# EAGLE schematic led_table_final (EAGLE 7.6.0)
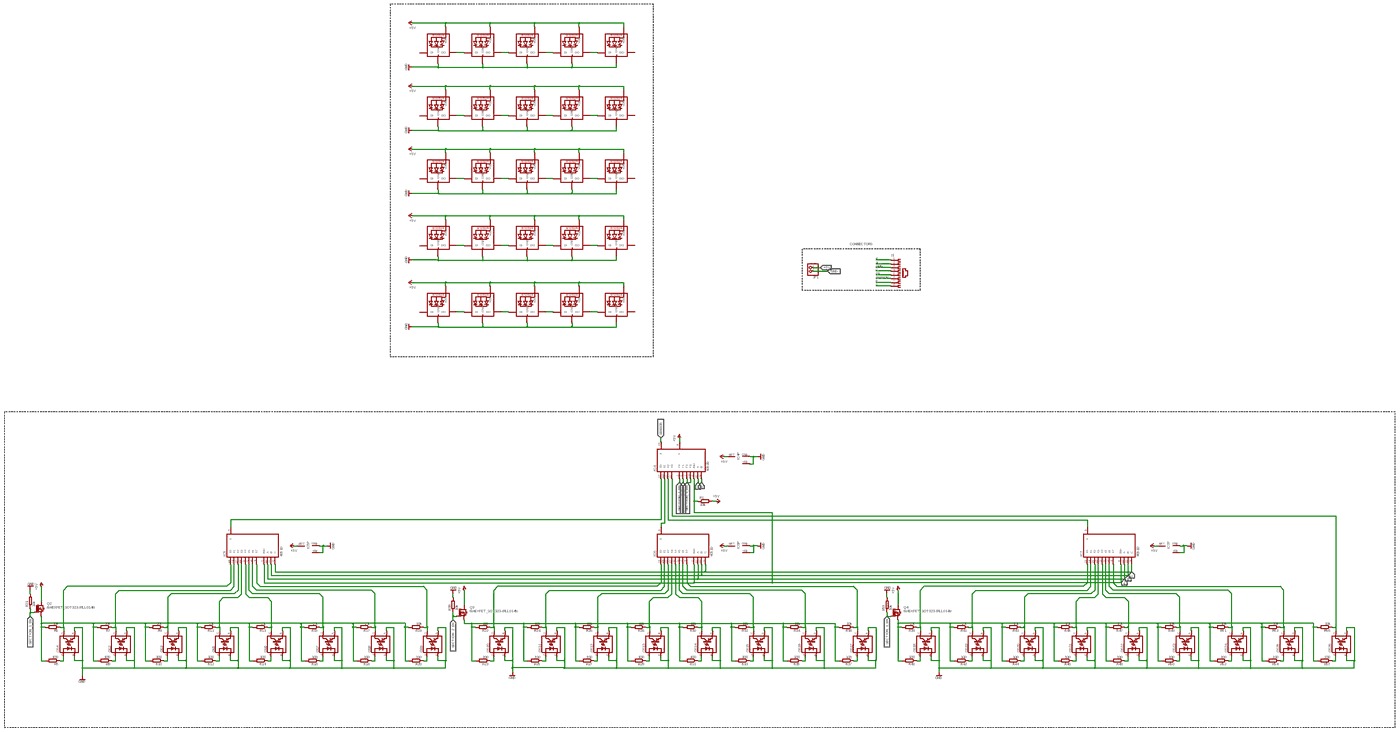
[diagram p0: schematic, sheet 1, overview]
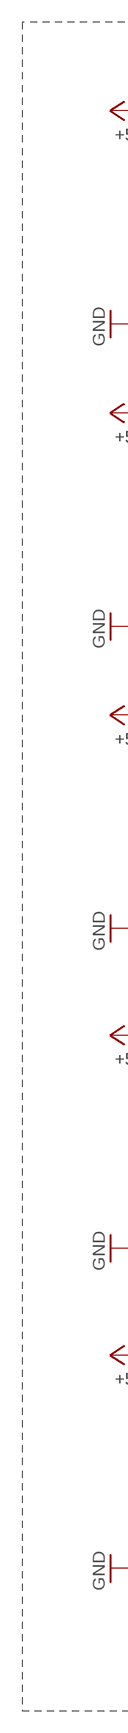
[diagram p1: schematic, sheet 1, part 1 of 5]
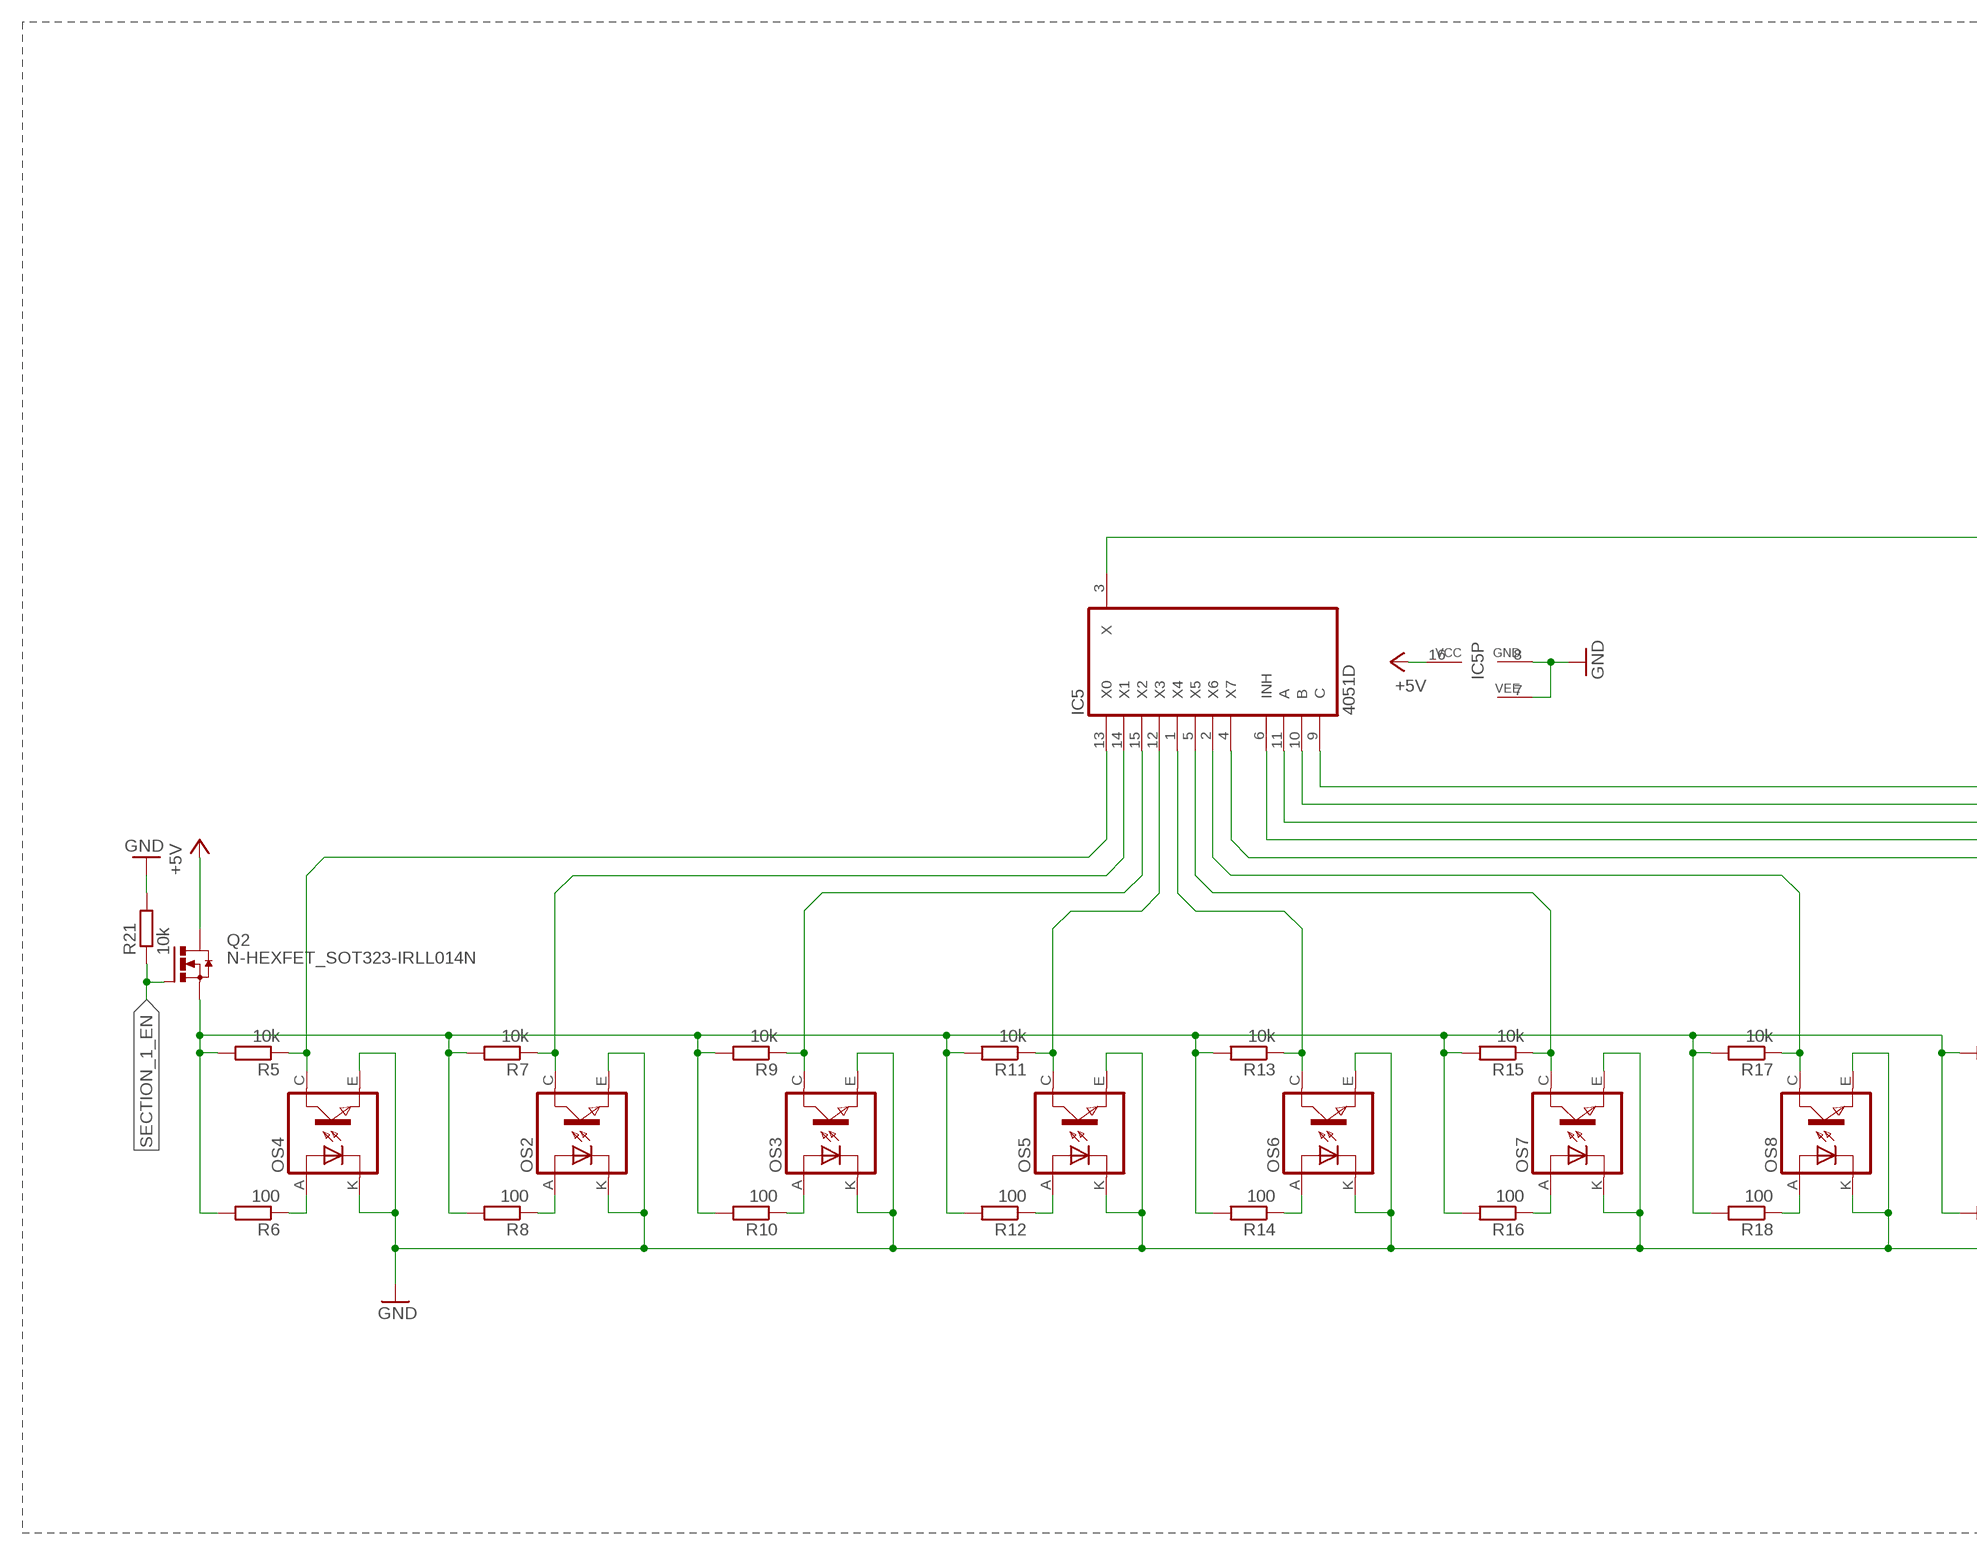
[diagram p2: schematic, sheet 1, part 2 of 5]
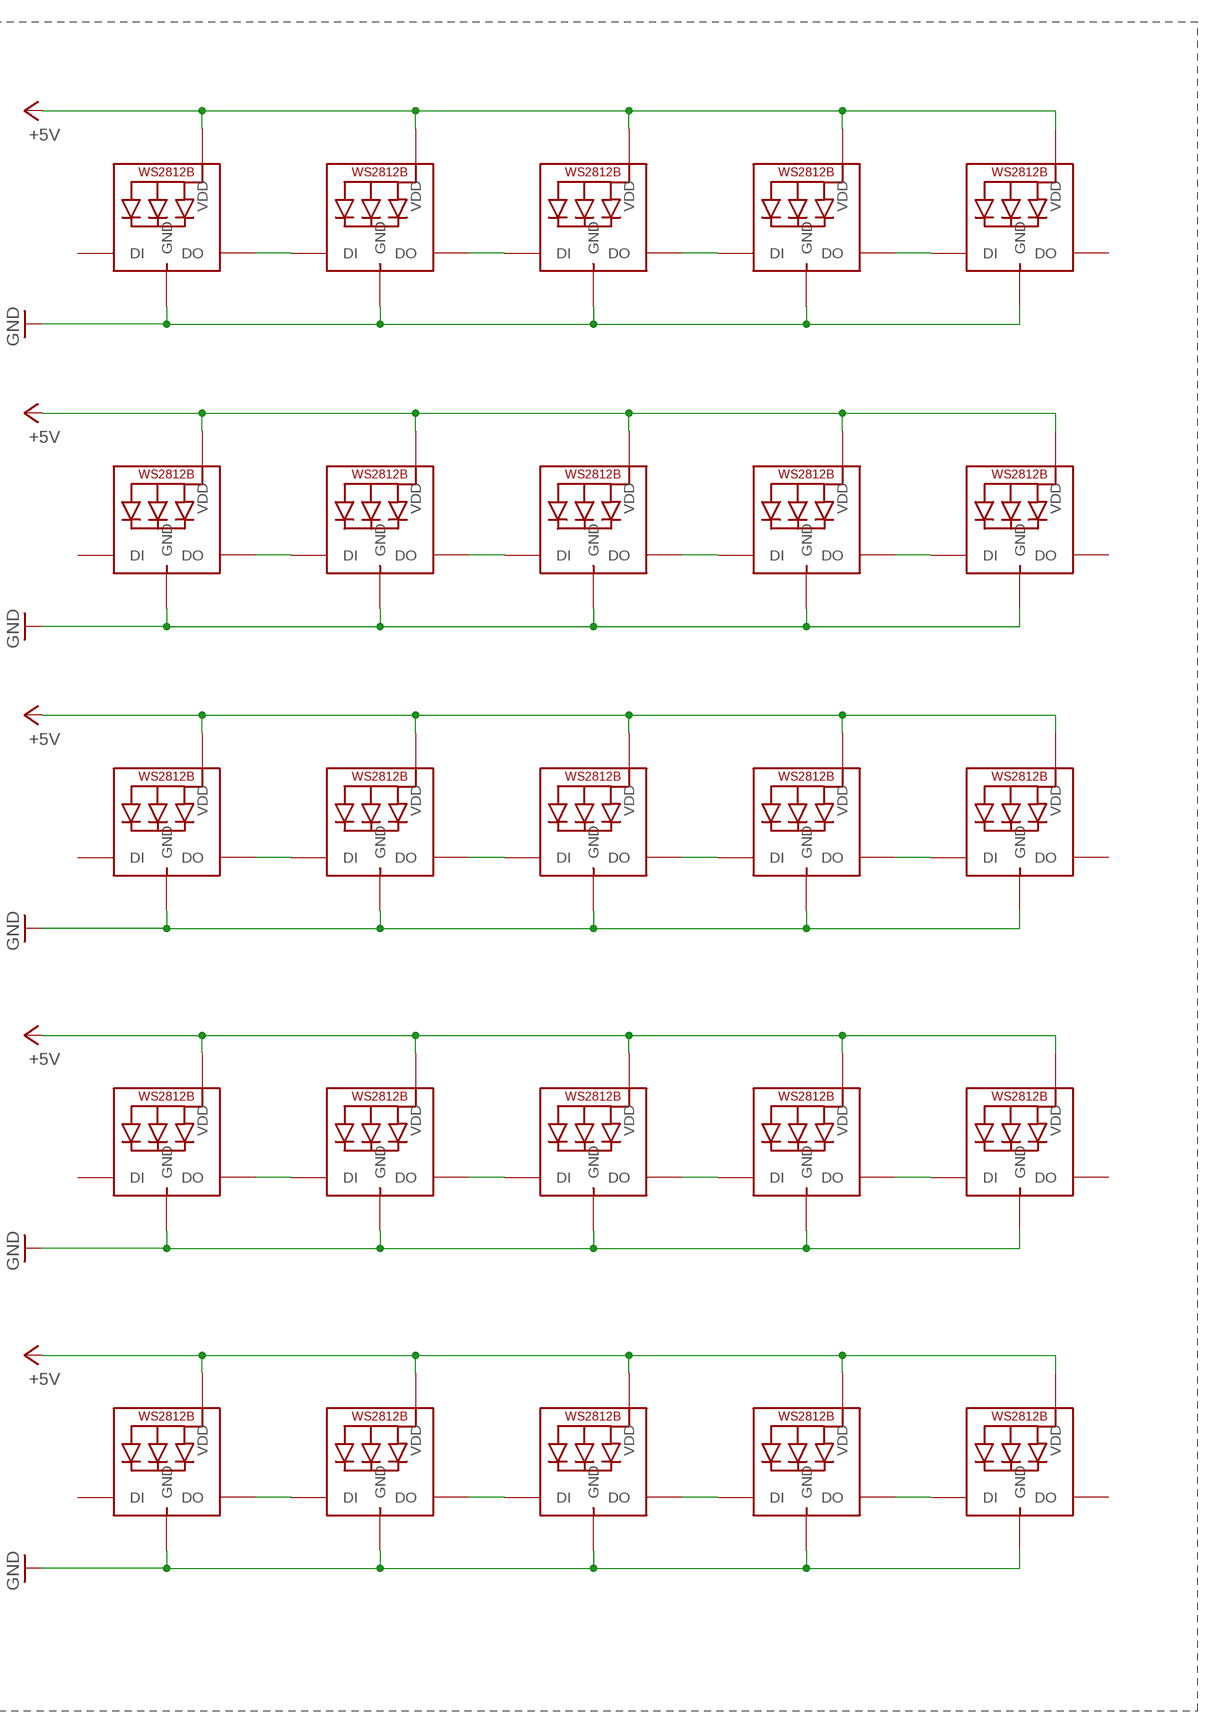
[diagram p3: schematic, sheet 1, part 3 of 5]
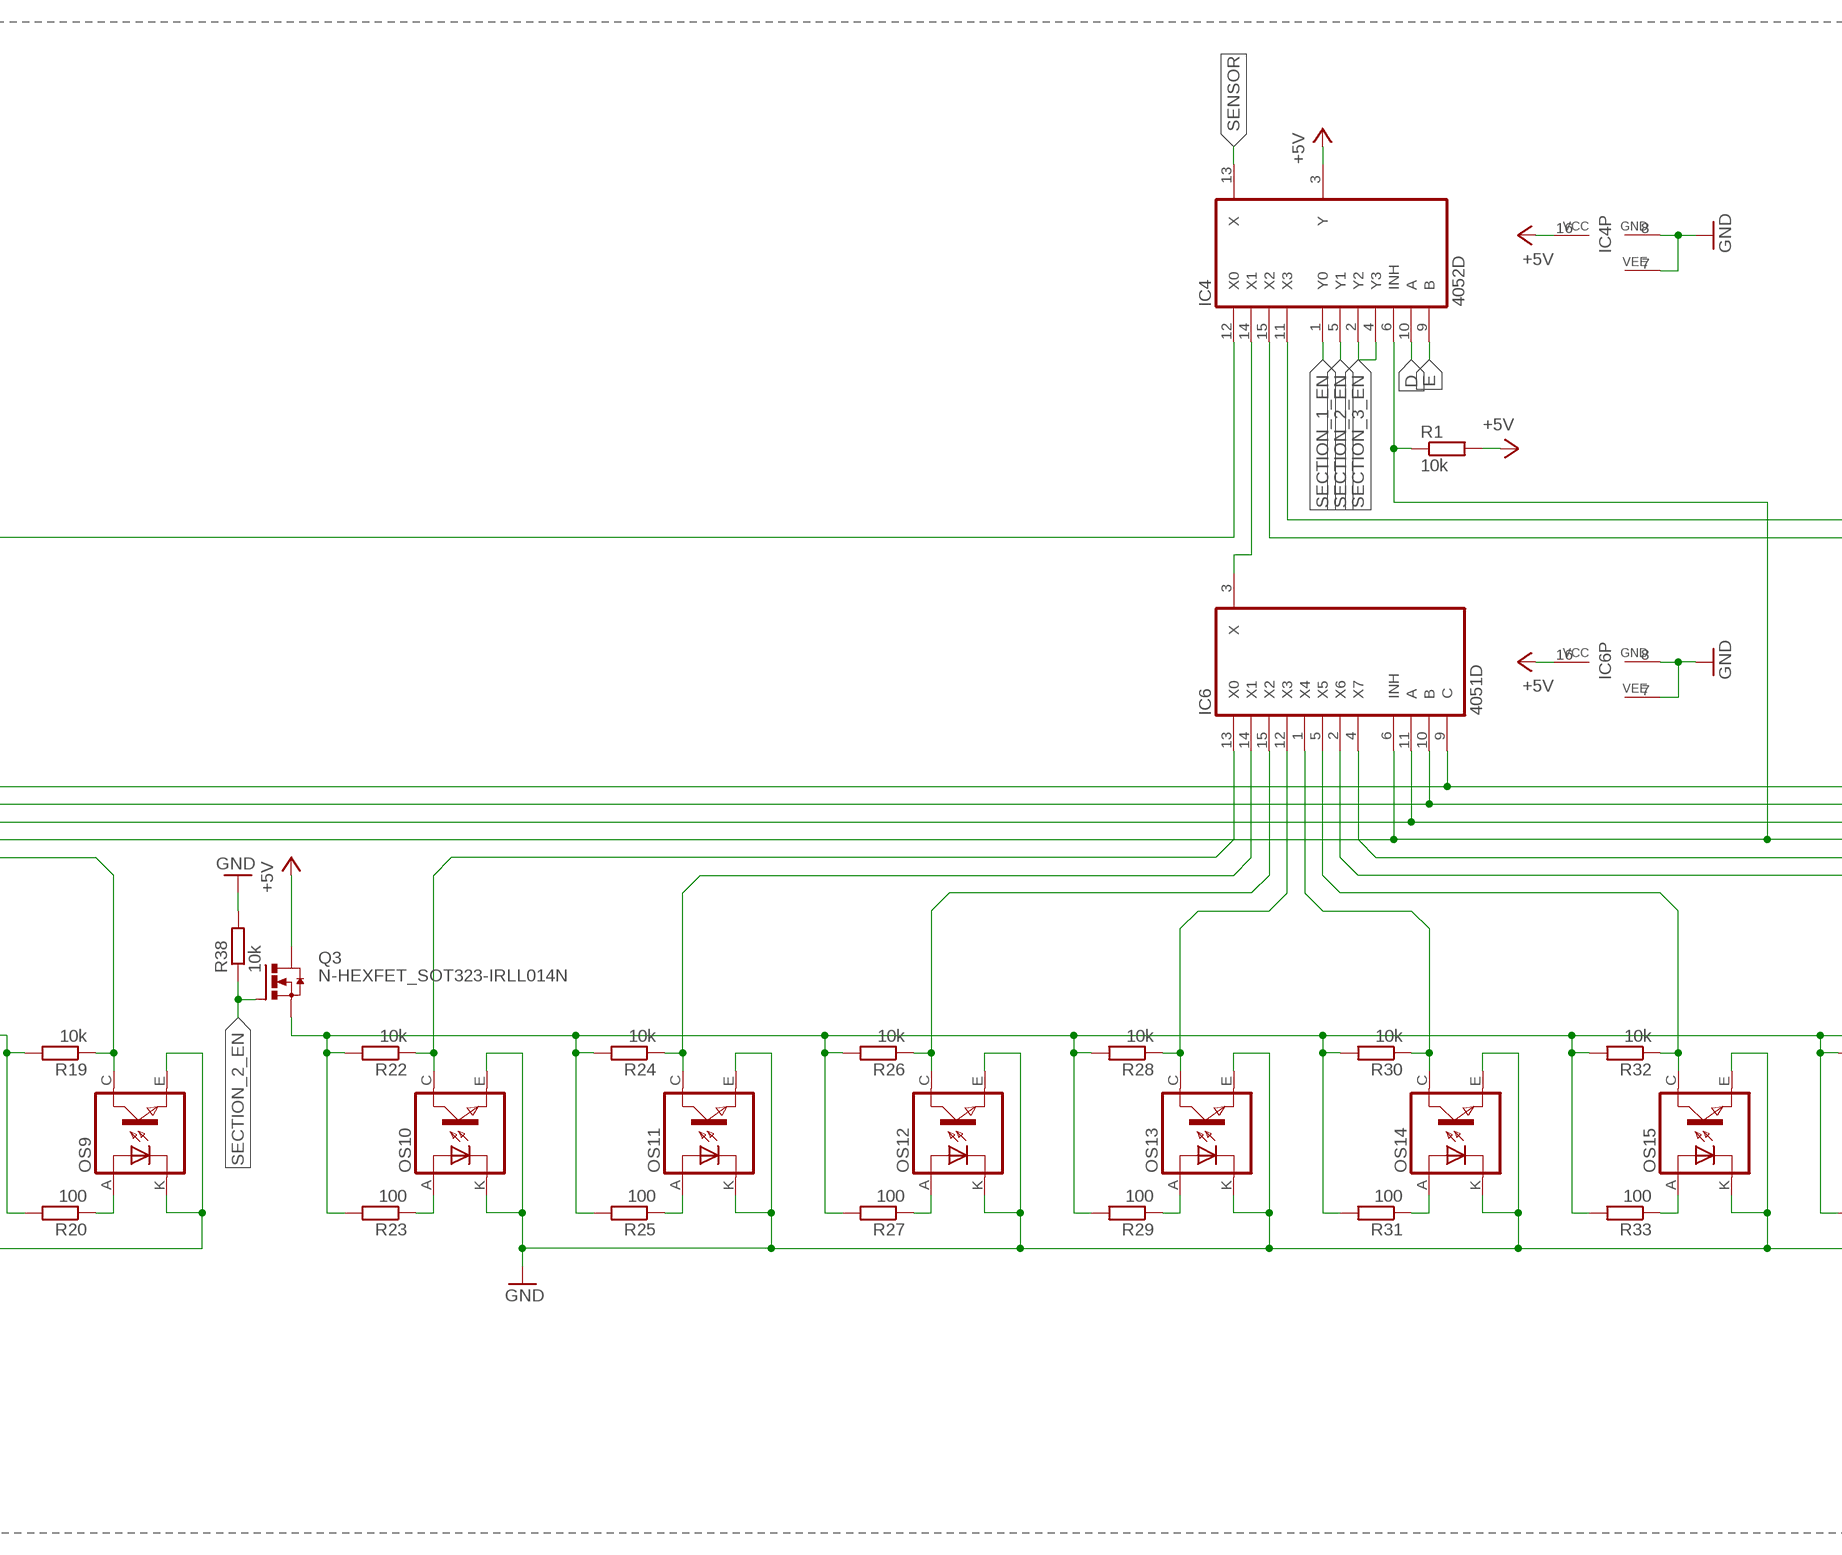
[diagram p4: schematic, sheet 1, part 4 of 5]
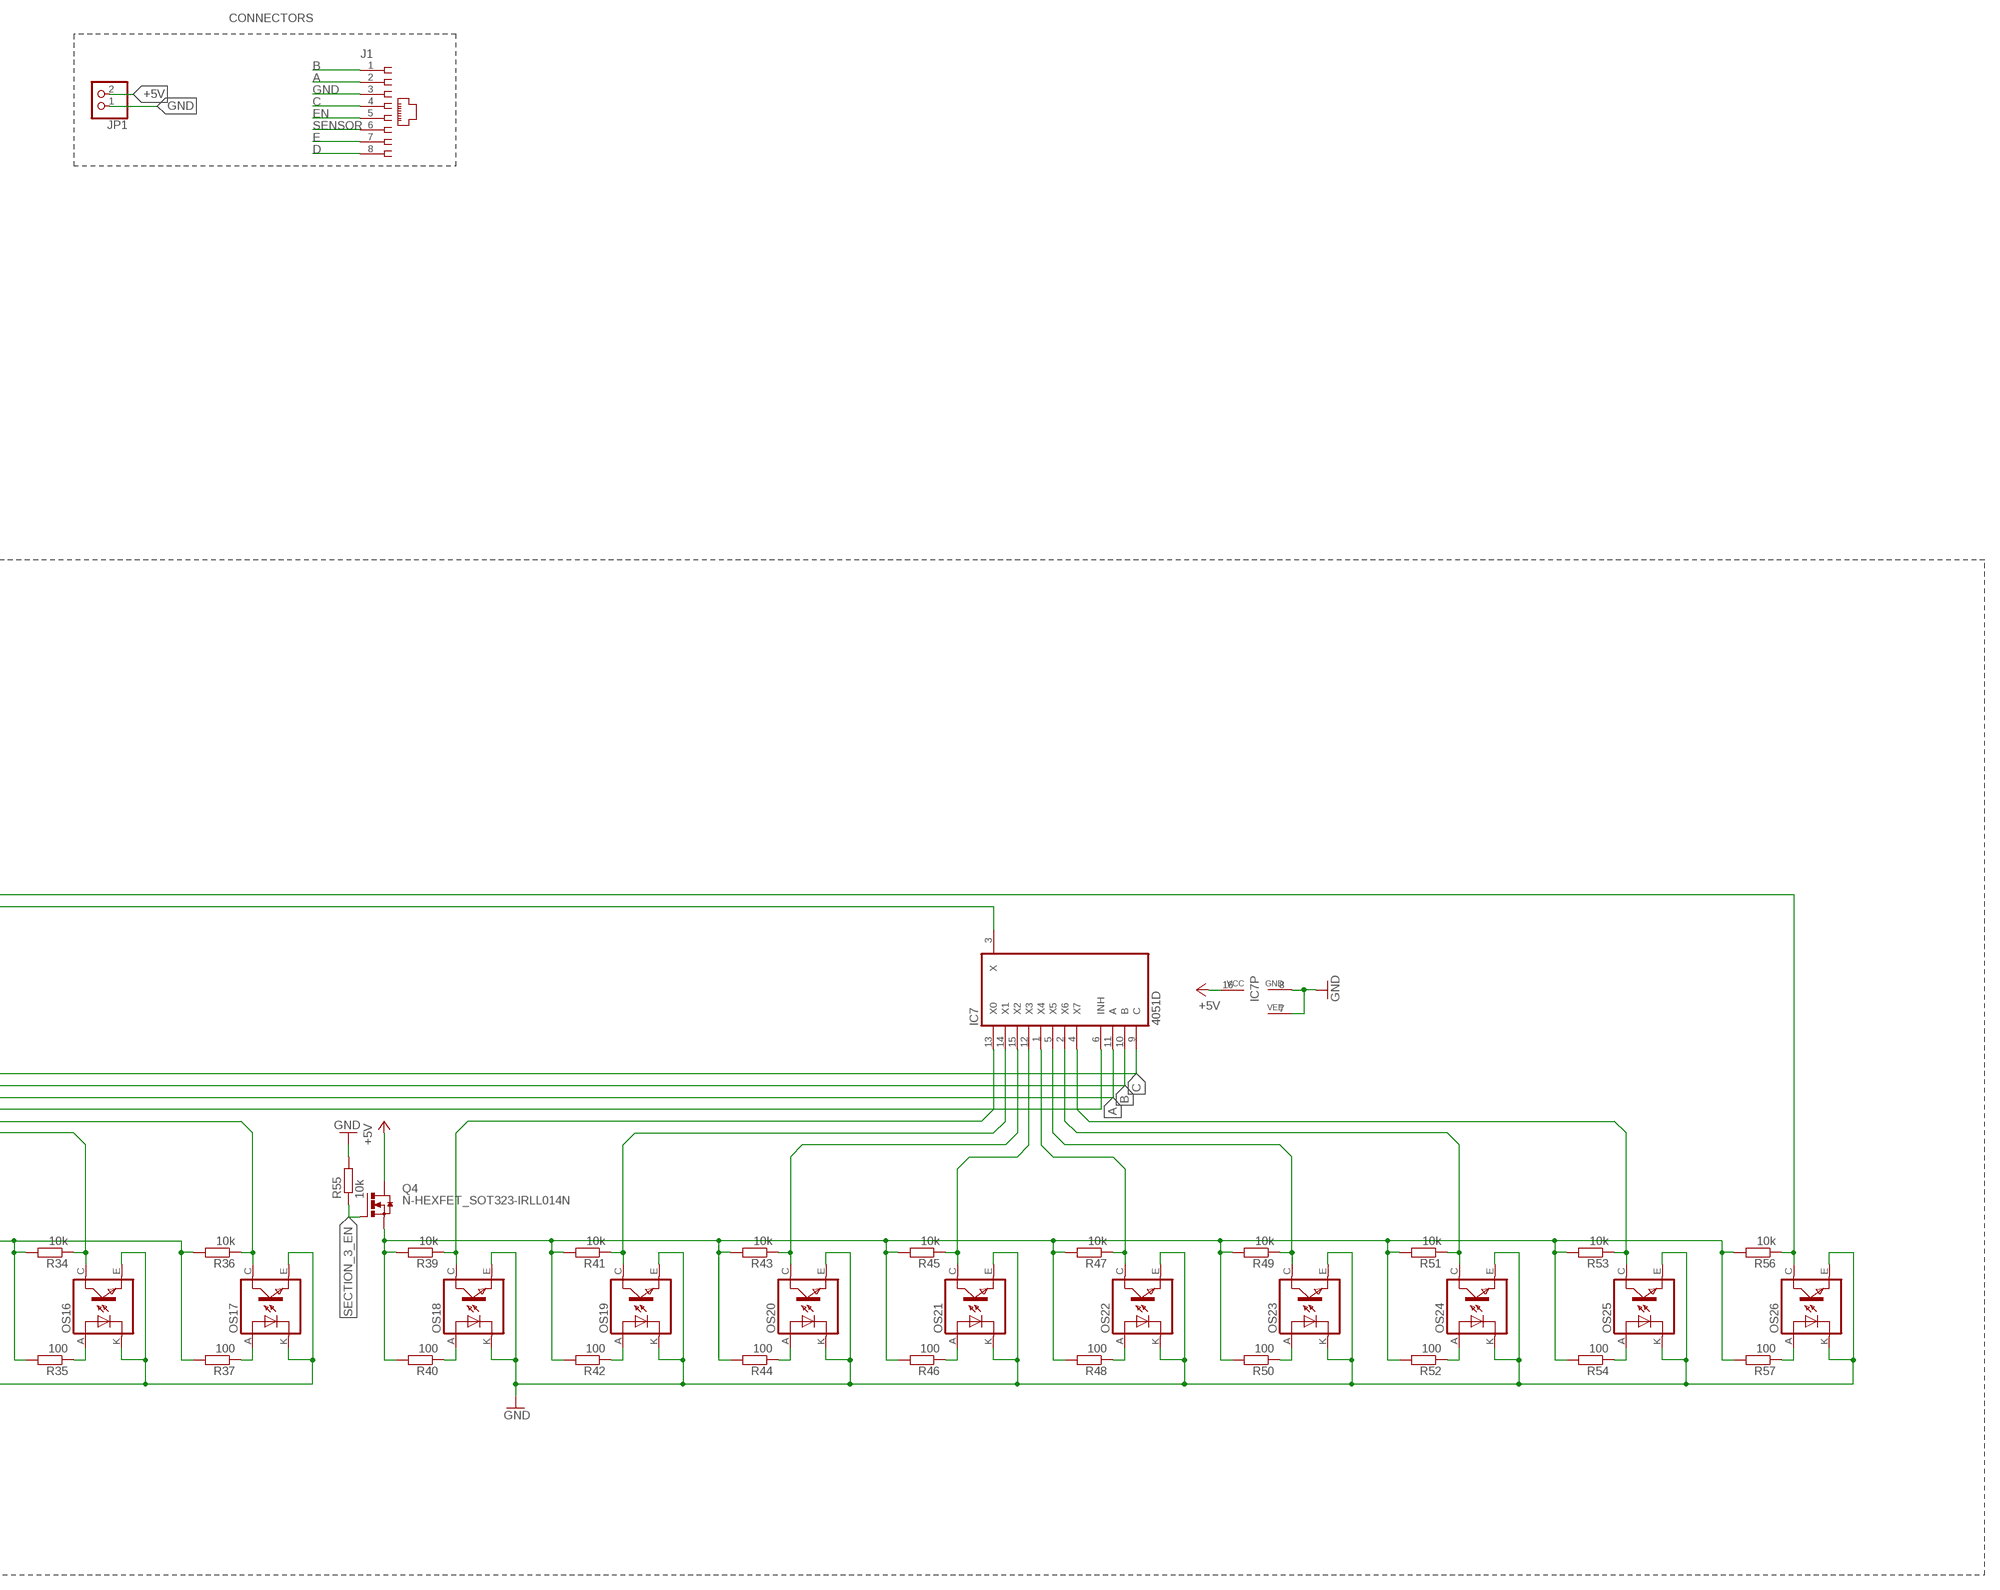
[diagram p5: schematic, sheet 1, part 5 of 5]

## Parts
IC4  4052D  [SO16]
IC5  4051D  [SO16]
IC6  4051D  [SO16]
IC7  4051D  [SO16]
J1  556416-1  [556416-1]
JP1  PINHD-1X2  [1X02]
LED1  WS2812B  [WS2812B_ON_STRIP]
LED2  WS2812B  [WS2812B_ON_STRIP]
LED3  WS2812B  [WS2812B_ON_STRIP]
LED4  WS2812B  [WS2812B_ON_STRIP]
LED5  WS2812B  [WS2812B_ON_STRIP]
LED6  WS2812B  [WS2812B_ON_STRIP]
LED7  WS2812B  [WS2812B_ON_STRIP]
LED8  WS2812B  [WS2812B_ON_STRIP]
LED9  WS2812B  [WS2812B_ON_STRIP]
LED10  WS2812B  [WS2812B_ON_STRIP]
LED11  WS2812B  [WS2812B_ON_STRIP]
LED12  WS2812B  [WS2812B_ON_STRIP]
LED13  WS2812B  [WS2812B_ON_STRIP]
LED14  WS2812B  [WS2812B_ON_STRIP]
LED15  WS2812B  [WS2812B_ON_STRIP]
LED16  WS2812B  [WS2812B_ON_STRIP]
LED17  WS2812B  [WS2812B_ON_STRIP]
LED18  WS2812B  [WS2812B_ON_STRIP]
LED19  WS2812B  [WS2812B_ON_STRIP]
LED20  WS2812B  [WS2812B_ON_STRIP]
LED21  WS2812B  [WS2812B_ON_STRIP]
LED22  WS2812B  [WS2812B_ON_STRIP]
LED23  WS2812B  [WS2812B_ON_STRIP]
LED24  WS2812B  [WS2812B_ON_STRIP]
LED25  WS2812B  [WS2812B_ON_STRIP]
OS2  TCRT5000  [TCRT5000]
OS3  TCRT5000  [TCRT5000]
OS4  TCRT5000  [TCRT5000]
OS5  TCRT5000  [TCRT5000]
OS6  TCRT5000  [TCRT5000]
OS7  TCRT5000  [TCRT5000]
OS8  TCRT5000  [TCRT5000]
OS9  TCRT5000  [TCRT5000]
OS10  TCRT5000  [TCRT5000]
OS11  TCRT5000  [TCRT5000]
OS12  TCRT5000  [TCRT5000]
OS13  TCRT5000  [TCRT5000]
OS14  TCRT5000  [TCRT5000]
OS15  TCRT5000  [TCRT5000]
OS16  TCRT5000  [TCRT5000]
OS17  TCRT5000  [TCRT5000]
OS18  TCRT5000  [TCRT5000]
OS19  TCRT5000  [TCRT5000]
OS20  TCRT5000  [TCRT5000]
OS21  TCRT5000  [TCRT5000]
OS22  TCRT5000  [TCRT5000]
OS23  TCRT5000  [TCRT5000]
OS24  TCRT5000  [TCRT5000]
OS25  TCRT5000  [TCRT5000]
OS26  TCRT5000  [TCRT5000]
Q2  N-HEXFET_SOT323-IRLL014N  [SOT223]
Q3  N-HEXFET_SOT323-IRLL014N  [SOT223]
Q4  N-HEXFET_SOT323-IRLL014N  [SOT223]
R1  10k  R-EU_R1206  [R1206]
R5  10k  R-EU_R1206  [R1206]
R6  100  R-EU_R1206  [R1206]
R7  10k  R-EU_R1206  [R1206]
R8  100  R-EU_R1206  [R1206]
R9  10k  R-EU_R1206  [R1206]
R10  100  R-EU_R1206  [R1206]
R11  10k  R-EU_R1206  [R1206]
R12  100  R-EU_R1206  [R1206]
R13  10k  R-EU_R1206  [R1206]
R14  100  R-EU_R1206  [R1206]
R15  10k  R-EU_R1206  [R1206]
R16  100  R-EU_R1206  [R1206]
R17  10k  R-EU_R1206  [R1206]
R18  100  R-EU_R1206  [R1206]
R19  10k  R-EU_R1206  [R1206]
R20  100  R-EU_R1206  [R1206]
R21  10k  R-EU_R1206  [R1206]
R22  10k  R-EU_R1206  [R1206]
R23  100  R-EU_R1206  [R1206]
R24  10k  R-EU_R1206  [R1206]
R25  100  R-EU_R1206  [R1206]
R26  10k  R-EU_R1206  [R1206]
R27  100  R-EU_R1206  [R1206]
R28  10k  R-EU_R1206  [R1206]
R29  100  R-EU_R1206  [R1206]
R30  10k  R-EU_R1206  [R1206]
R31  100  R-EU_R1206  [R1206]
R32  10k  R-EU_R1206  [R1206]
R33  100  R-EU_R1206  [R1206]
R34  10k  R-EU_R1206  [R1206]
R35  100  R-EU_R1206  [R1206]
R36  10k  R-EU_R1206  [R1206]
R37  100  R-EU_R1206  [R1206]
R38  10k  R-EU_R1206  [R1206]
R39  10k  R-EU_R1206  [R1206]
R40  100  R-EU_R1206  [R1206]
R41  10k  R-EU_R1206  [R1206]
R42  100  R-EU_R1206  [R1206]
R43  10k  R-EU_R1206  [R1206]
R44  100  R-EU_R1206  [R1206]
R45  10k  R-EU_R1206  [R1206]
R46  100  R-EU_R1206  [R1206]
R47  10k  R-EU_R1206  [R1206]
R48  100  R-EU_R1206  [R1206]
R49  10k  R-EU_R1206  [R1206]
R50  100  R-EU_R1206  [R1206]
R51  10k  R-EU_R1206  [R1206]
R52  100  R-EU_R1206  [R1206]
R53  10k  R-EU_R1206  [R1206]
R54  100  R-EU_R1206  [R1206]
R55  10k  R-EU_R1206  [R1206]
R56  10k  R-EU_R1206  [R1206]
R57  100  R-EU_R1206  [R1206]

## Nets
+5V: IC4.3(Y) IC4.16(VCC) IC5.16(VCC) IC6.16(VCC) IC7.16(VCC) JP1.2 LED1.VCC_IN(VDD) LED1.VCC_OUT(VDD) LED2.VCC_IN(VDD) LED2.VCC_OUT(VDD) LED3.VCC_IN(VDD) LED3.VCC_OUT(VDD) LED4.VCC_IN(VDD) LED4.VCC_OUT(VDD) LED5.VCC_IN(VDD) LED5.VCC_OUT(VDD) LED6.VCC_IN(VDD) LED6.VCC_OUT(VDD) LED7.VCC_IN(VDD) LED7.VCC_OUT(VDD) LED8.VCC_IN(VDD) LED8.VCC_OUT(VDD) LED9.VCC_IN(VDD) LED9.VCC_OUT(VDD) LED10.VCC_IN(VDD) LED10.VCC_OUT(VDD) LED11.VCC_IN(VDD) LED11.VCC_OUT(VDD) LED12.VCC_IN(VDD) LED12.VCC_OUT(VDD) LED13.VCC_IN(VDD) LED13.VCC_OUT(VDD) LED14.VCC_IN(VDD) LED14.VCC_OUT(VDD) LED15.VCC_IN(VDD) LED15.VCC_OUT(VDD) LED16.VCC_IN(VDD) LED16.VCC_OUT(VDD) LED17.VCC_IN(VDD) LED17.VCC_OUT(VDD) LED18.VCC_IN(VDD) LED18.VCC_OUT(VDD) LED19.VCC_IN(VDD) LED19.VCC_OUT(VDD) LED20.VCC_IN(VDD) LED20.VCC_OUT(VDD) LED21.VCC_IN(VDD) LED21.VCC_OUT(VDD) LED22.VCC_IN(VDD) LED22.VCC_OUT(VDD) LED23.VCC_IN(VDD) LED23.VCC_OUT(VDD) LED24.VCC_IN(VDD) LED24.VCC_OUT(VDD) LED25.VCC_IN(VDD) LED25.VCC_OUT(VDD) Q2.4(D) Q3.4(D) Q4.4(D) R1.2
A: IC5.11(A) IC6.11(A) IC7.11(A) J1.2
B: IC5.10(B) IC6.10(B) IC7.10(B) J1.1
C: IC5.9(C) IC6.9(C) IC7.9(C) J1.4
D: IC4.10(A) J1.8
E: IC4.9(B) J1.7
EN: IC4.6(INH) IC5.6(INH) IC6.6(INH) IC7.6(INH) J1.5 R1.1
GND: IC4.7(VEE) IC4.8(GND) IC5.7(VEE) IC5.8(GND) IC6.7(VEE) IC6.8(GND) IC7.7(VEE) IC7.8(GND) J1.3 JP1.1 LED1.GND_IN(GND) LED1.GND_OUT(GND) LED2.GND_IN(GND) LED2.GND_OUT(GND) LED3.GND_IN(GND) LED3.GND_OUT(GND) LED4.GND_IN(GND) LED4.GND_OUT(GND) LED5.GND_IN(GND) LED5.GND_OUT(GND) LED6.GND_IN(GND) LED6.GND_OUT(GND) LED7.GND_IN(GND) LED7.GND_OUT(GND) LED8.GND_IN(GND) LED8.GND_OUT(GND) LED9.GND_IN(GND) LED9.GND_OUT(GND) LED10.GND_IN(GND) LED10.GND_OUT(GND) LED11.GND_IN(GND) LED11.GND_OUT(GND) LED12.GND_IN(GND) LED12.GND_OUT(GND) LED13.GND_IN(GND) LED13.GND_OUT(GND) LED14.GND_IN(GND) LED14.GND_OUT(GND) LED15.GND_IN(GND) LED15.GND_OUT(GND) LED16.GND_IN(GND) LED16.GND_OUT(GND) LED17.GND_IN(GND) LED17.GND_OUT(GND) LED18.GND_IN(GND) LED18.GND_OUT(GND) LED19.GND_IN(GND) LED19.GND_OUT(GND) LED20.GND_IN(GND) LED20.GND_OUT(GND) LED21.GND_IN(GND) LED21.GND_OUT(GND) LED22.GND_IN(GND) LED22.GND_OUT(GND) LED23.GND_IN(GND) LED23.GND_OUT(GND) LED24.GND_IN(GND) LED24.GND_OUT(GND) LED25.GND_IN(GND) LED25.GND_OUT(GND) OS2.E(EMITTER) OS2.K(CATHODE) OS3.E(EMITTER) OS3.K(CATHODE) OS4.E(EMITTER) OS4.K(CATHODE) OS5.E(EMITTER) OS5.K(CATHODE) OS6.E(EMITTER) OS6.K(CATHODE) OS7.E(EMITTER) OS7.K(CATHODE) OS8.E(EMITTER) OS8.K(CATHODE) OS9.E(EMITTER) OS9.K(CATHODE) OS10.E(EMITTER) OS10.K(CATHODE) OS11.E(EMITTER) OS11.K(CATHODE) OS12.E(EMITTER) OS12.K(CATHODE) OS13.E(EMITTER) OS13.K(CATHODE) OS14.E(EMITTER) OS14.K(CATHODE) OS15.E(EMITTER) OS15.K(CATHODE) OS16.E(EMITTER) OS16.K(CATHODE) OS17.E(EMITTER) OS17.K(CATHODE) OS18.E(EMITTER) OS18.K(CATHODE) OS19.E(EMITTER) OS19.K(CATHODE) OS20.E(EMITTER) OS20.K(CATHODE) OS21.E(EMITTER) OS21.K(CATHODE) OS22.E(EMITTER) OS22.K(CATHODE) OS23.E(EMITTER) OS23.K(CATHODE) OS24.E(EMITTER) OS24.K(CATHODE) OS25.E(EMITTER) OS25.K(CATHODE) OS26.E(EMITTER) OS26.K(CATHODE) R21.2 R38.2 R55.2
N$1: Q3.3(S) R22.2 R23.2 R24.2 R25.2 R26.2 R27.2 R28.2 R29.2 R30.2 R31.2 R32.2 R33.2 R34.2 R35.2 R36.2 R37.2
N$7: Q2.3(S) R5.2 R6.2 R7.2 R8.2 R9.2 R10.2 R11.2 R12.2 R13.2 R14.2 R15.2 R16.2 R17.2 R18.2 R19.2 R20.2
N$11: OS4.A(ANODE) R6.1
N$12: IC5.13(X0) OS4.C(COLLECTOR) R5.1
N$13: IC5.14(X1) OS2.C(COLLECTOR) R7.1
N$14: IC5.15(X2) OS3.C(COLLECTOR) R9.1
N$15: OS2.A(ANODE) R8.1
N$16: IC5.1(X4) OS6.C(COLLECTOR) R13.1
N$17: IC6.13(X0) OS10.C(COLLECTOR) R22.1
N$18: OS3.A(ANODE) R10.1
N$19: OS10.A(ANODE) R23.1
N$20: IC5.12(X3) OS5.C(COLLECTOR) R11.1
N$21: OS5.A(ANODE) R12.1
N$22: IC6.14(X1) OS11.C(COLLECTOR) R24.1
N$23: OS11.A(ANODE) R25.1
N$24: OS6.A(ANODE) R14.1
N$25: OS12.A(ANODE) R27.1
N$26: IC5.5(X5) OS7.C(COLLECTOR) R15.1
N$27: OS7.A(ANODE) R16.1
N$28: IC6.12(X3) OS13.C(COLLECTOR) R28.1
N$29: IC5.2(X6) OS8.C(COLLECTOR) R17.1
N$30: OS8.A(ANODE) R18.1
N$32: IC5.4(X7) OS9.C(COLLECTOR) R19.1
N$33: OS9.A(ANODE) R20.1
N$34: OS13.A(ANODE) R29.1
N$36: OS14.A(ANODE) R31.1
N$37: IC6.5(X5) OS15.C(COLLECTOR) R32.1
N$38: OS15.A(ANODE) R33.1
N$39: IC6.2(X6) OS16.C(COLLECTOR) R34.1
N$40: OS16.A(ANODE) R35.1
N$42: IC6.4(X7) OS17.C(COLLECTOR) R36.1
N$43: OS17.A(ANODE) R37.1
N$45: IC6.15(X2) OS12.C(COLLECTOR) R26.1
N$46: IC6.1(X4) OS14.C(COLLECTOR) R30.1
N$47: IC7.13(X0) OS18.C(COLLECTOR) R39.1
N$48: OS18.A(ANODE) R40.1
N$49: IC7.14(X1) OS19.C(COLLECTOR) R41.1
N$50: OS19.A(ANODE) R42.1
N$51: OS20.A(ANODE) R44.1
N$52: IC7.12(X3) OS21.C(COLLECTOR) R45.1
N$53: OS21.A(ANODE) R46.1
N$54: OS22.A(ANODE) R48.1
N$55: IC7.5(X5) OS23.C(COLLECTOR) R49.1
N$56: OS23.A(ANODE) R50.1
N$57: IC7.2(X6) OS24.C(COLLECTOR) R51.1
N$58: OS24.A(ANODE) R52.1
N$60: IC7.4(X7) OS25.C(COLLECTOR) R53.1
N$61: OS25.A(ANODE) R54.1
N$63: IC7.15(X2) OS20.C(COLLECTOR) R43.1
N$64: IC7.1(X4) OS22.C(COLLECTOR) R47.1
N$68: Q4.3(S) R39.2 R40.2 R41.2 R42.2 R43.2 R44.2 R45.2 R46.2 R47.2 R48.2 R49.2 R50.2 R51.2 R52.2 R53.2 R54.2 R56.2 R57.2
N$69: IC4.12(X0) IC5.3(X)
N$70: IC4.14(X1) IC6.3(X)
N$71: IC4.15(X2) IC7.3(X)
N$72: IC4.11(X3) OS26.C(COLLECTOR) R56.1
N$75: OS26.A(ANODE) R57.1
N$117: LED1.D_OUT(DO) LED2.D_IN(DI)
N$118: LED2.D_OUT(DO) LED3.D_IN(DI)
N$119: LED3.D_OUT(DO) LED4.D_IN(DI)
N$120: LED4.D_OUT(DO) LED5.D_IN(DI)
N$123: LED6.D_OUT(DO) LED7.D_IN(DI)
N$124: LED7.D_OUT(DO) LED8.D_IN(DI)
N$125: LED8.D_OUT(DO) LED9.D_IN(DI)
N$126: LED9.D_OUT(DO) LED10.D_IN(DI)
N$127: LED11.D_OUT(DO) LED12.D_IN(DI)
N$128: LED12.D_OUT(DO) LED13.D_IN(DI)
N$129: LED13.D_OUT(DO) LED14.D_IN(DI)
N$130: LED14.D_OUT(DO) LED15.D_IN(DI)
N$131: LED16.D_OUT(DO) LED17.D_IN(DI)
N$132: LED17.D_OUT(DO) LED18.D_IN(DI)
N$133: LED18.D_OUT(DO) LED19.D_IN(DI)
N$134: LED19.D_OUT(DO) LED20.D_IN(DI)
N$135: LED21.D_OUT(DO) LED22.D_IN(DI)
N$136: LED22.D_OUT(DO) LED23.D_IN(DI)
N$137: LED23.D_OUT(DO) LED24.D_IN(DI)
N$138: LED24.D_OUT(DO) LED25.D_IN(DI)
SECTION_1_EN: IC4.1(Y0) Q2.1(G) R21.1
SECTION_2_EN: IC4.5(Y1) Q3.1(G) R38.1
SECTION_3_EN: IC4.2(Y2) IC4.4(Y3) Q4.1(G) R55.1
SENSOR: IC4.13(X) J1.6
Unconnected: LED1.D_IN(DI) LED5.D_OUT(DO) LED6.D_IN(DI) LED10.D_OUT(DO) LED11.D_IN(DI) LED15.D_OUT(DO) LED16.D_IN(DI) LED20.D_OUT(DO) LED21.D_IN(DI) LED25.D_OUT(DO)

## Notes on the sheet
- CONNECTORS

## Library data of the parts
IC4 = 40xx:4052: Dual 4-channel ANALOG MULTIPLEXER
IC5-IC7 = 40xx:4051: 8-channel ANALOG MULTIPLEXER
J1 = con-amp:556416-1: AMP connector
JP1 = pinhead:PINHD-1X2: PIN HEADER
LED1-LED25 = adafruit:WS2812B
OS2-OS26 = tcrt5000:TCRT5000
Q2-Q4 = transistor-power:N-HEXFET_?-*: HEXFET® Power MOSFET
R1 R5-R57 = rcl:R-EU_: RESISTOR, European symbol